# Altium schematic sheet MPU_1.SchDoc
size A4
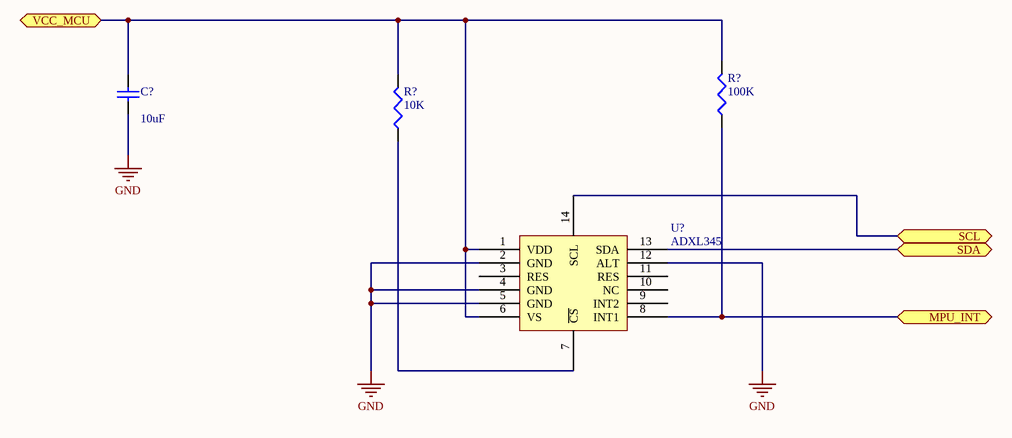
[diagram p0: MPU_1.SchDoc]

## Parts
(Parts that share a designator on the sheet are numbered #1, #2 ... from top to bottom, then left to right.)
C?  value 10uF  [C1206]  (hidden comment: Cap Semi)
R?#1  value 100K  [12Z-2010]  (hidden comment: Res3)
R?#2  value 10K  [12Z-2010]  (hidden comment: Res3)
U?  ADXL345

## Ports
MPU_INT (bidir), SCL (bidir), SDA (bidir), VCC_MCU (bidir)

## Nets
GND: C?.1 U?.2(GND) U?.4(GND) U?.5(GND) U?.12(ALT)
MPU_INT: R?#1.1 U?.8(INT1) ; port MPU_INT
SCL: U?.14(SCL) ; port SCL
SDA: U?.13(SDA) ; port SDA
VCC_MCU: C?.2 R?#1.2 R?#2.2 U?.1(VDD) U?.6(VS) ; port VCC_MCU
NetR?#2_1: R?#2.1 U?.7(~{CS})

Not connected (* = marked no-connect by the designer): U? 3(RES) 9(INT2) 10(NC) 11(RES)

## Library data of the parts
C? = Cap Semi: Capacitor (Semiconductor SIM Model); Published: 8-Jun-2000; LatestRevisionDate: 29-May-2009; LatestRevisionNote: IPC-7351 Footprint Added.; PackageReference: C1206; Publisher: Altium Limited; PackageDescription: Chip Capacitor
R?#1 R?#2 = Res3: Resistor; Published: 8-Jun-2000; LatestRevisionDate: 29-May-2009; LatestRevisionNote: IPC-7351 Footprint Added.; PackageReference: J1-0603; Publisher: Altium Limited; PackageDescription: Chip Resistor